# EAGLE schematic hydrogen_sensors_board_v4.0 (EAGLE 9.4.2)
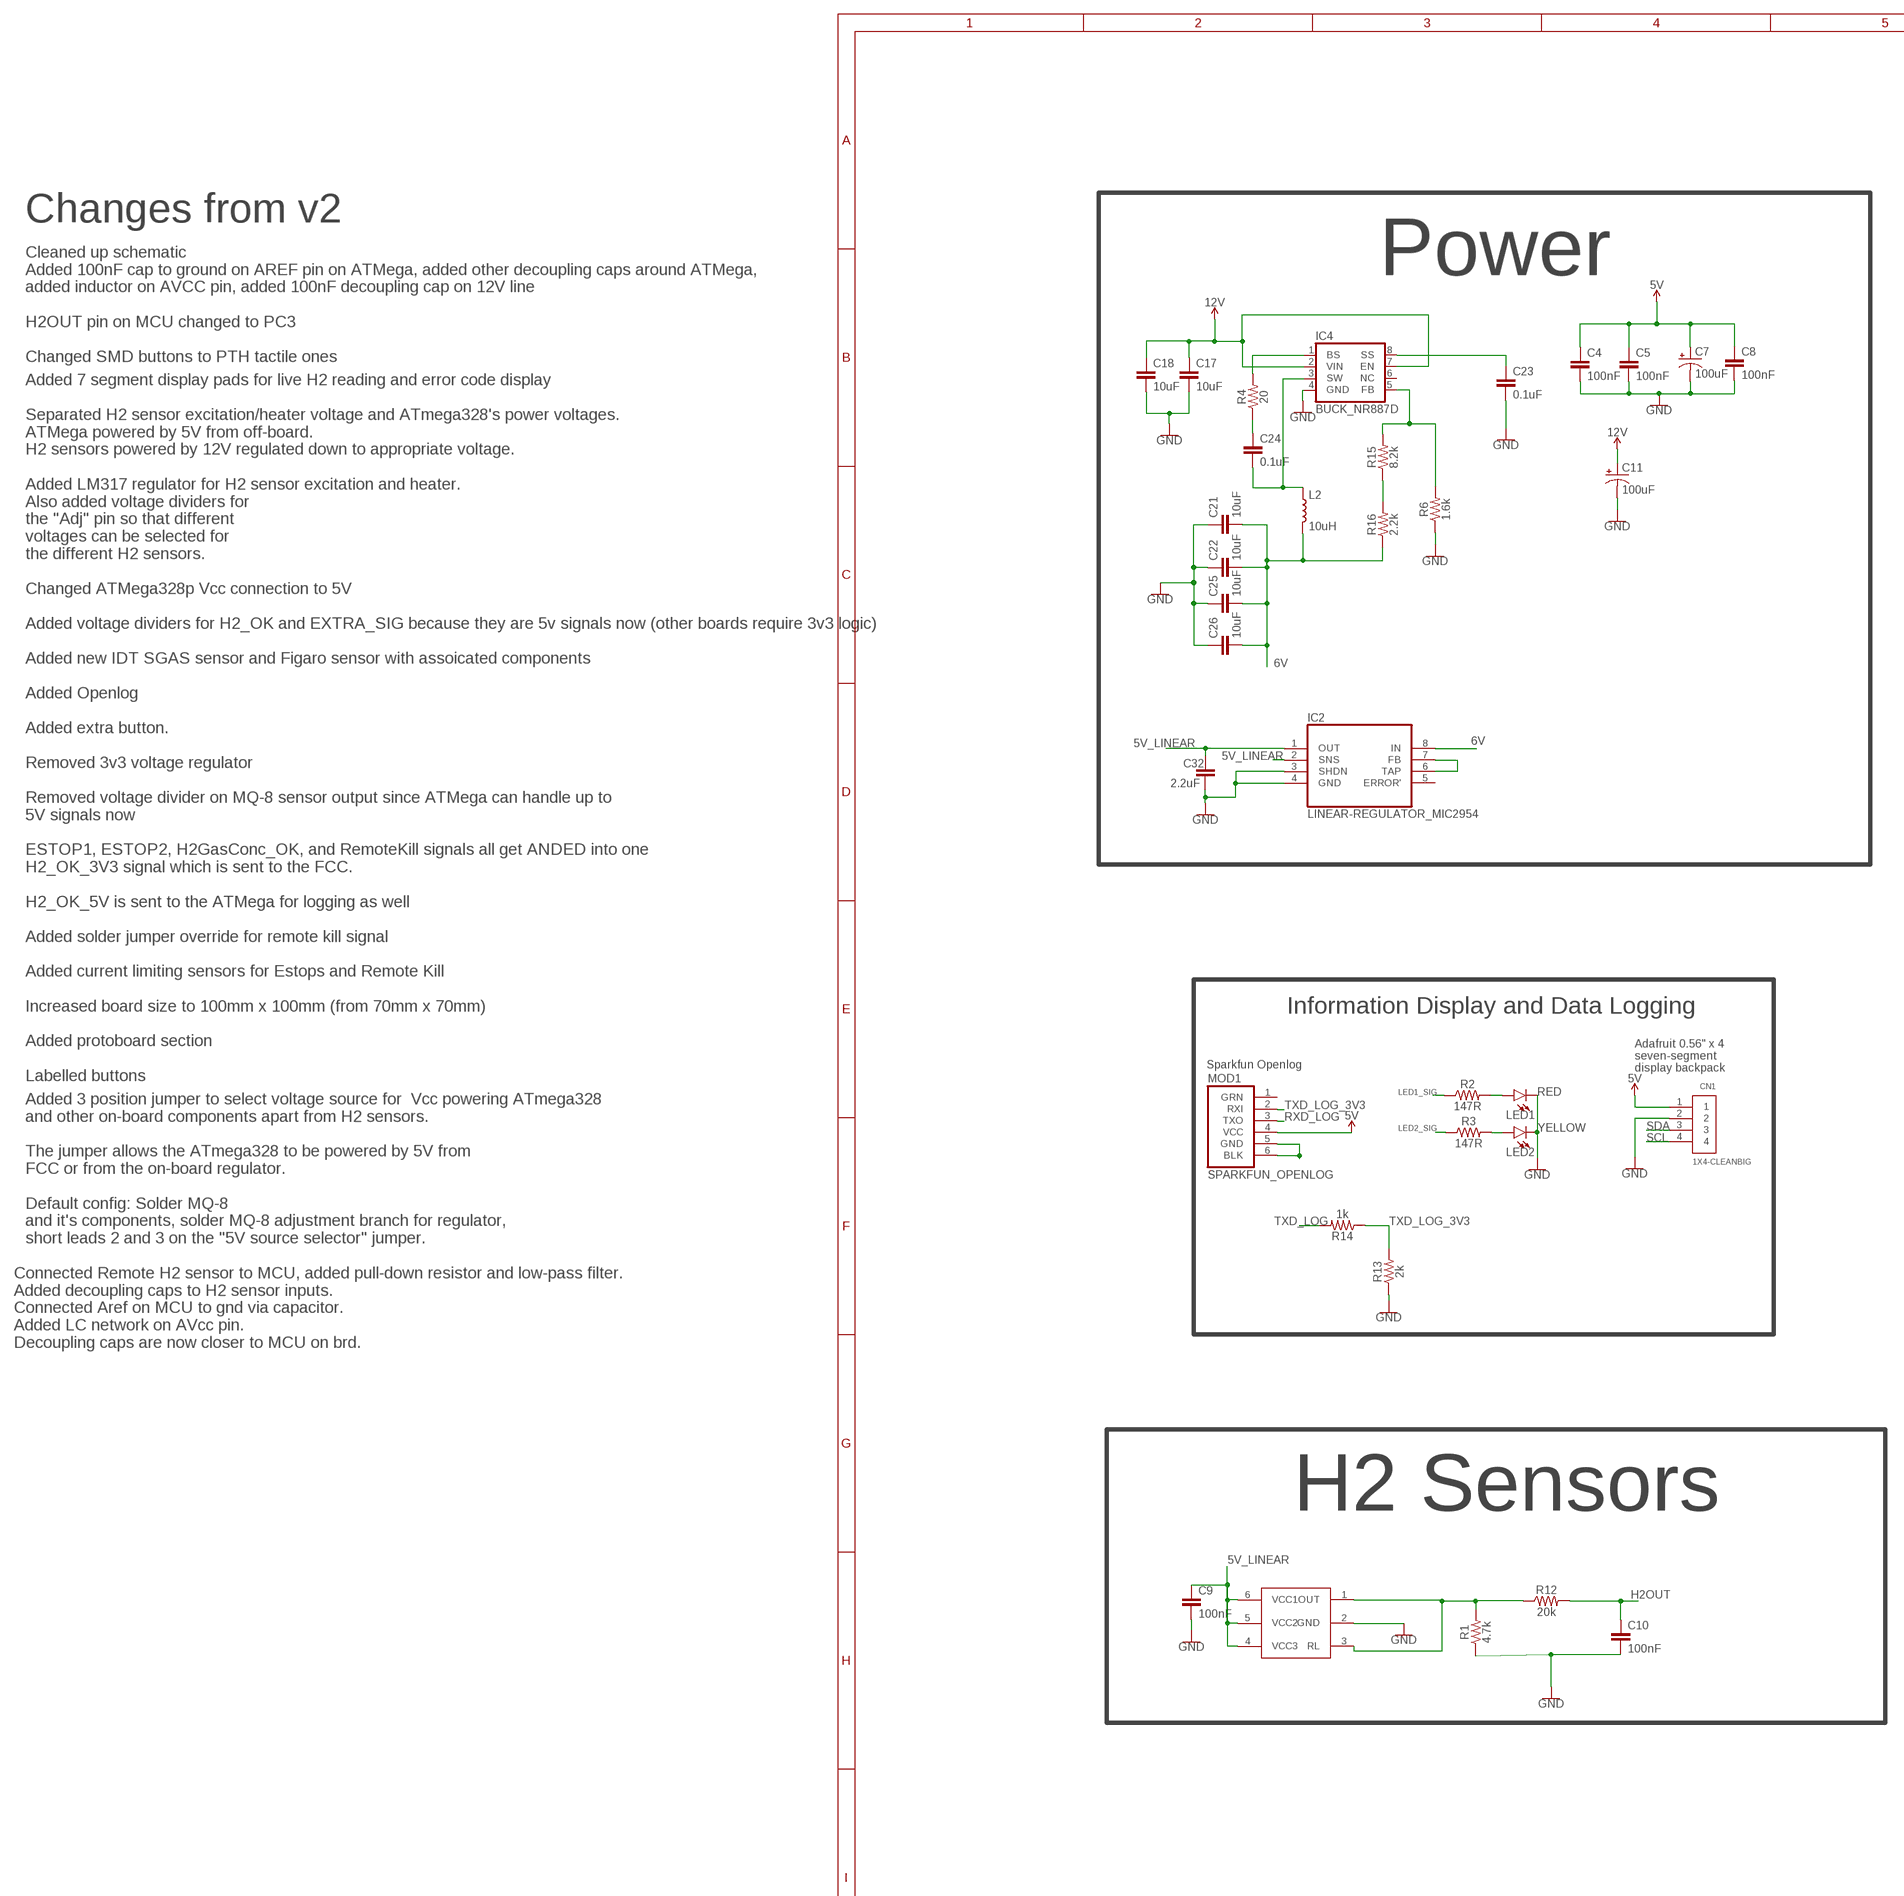
[diagram p0: schematic, sheet 1, part 1 of 2]
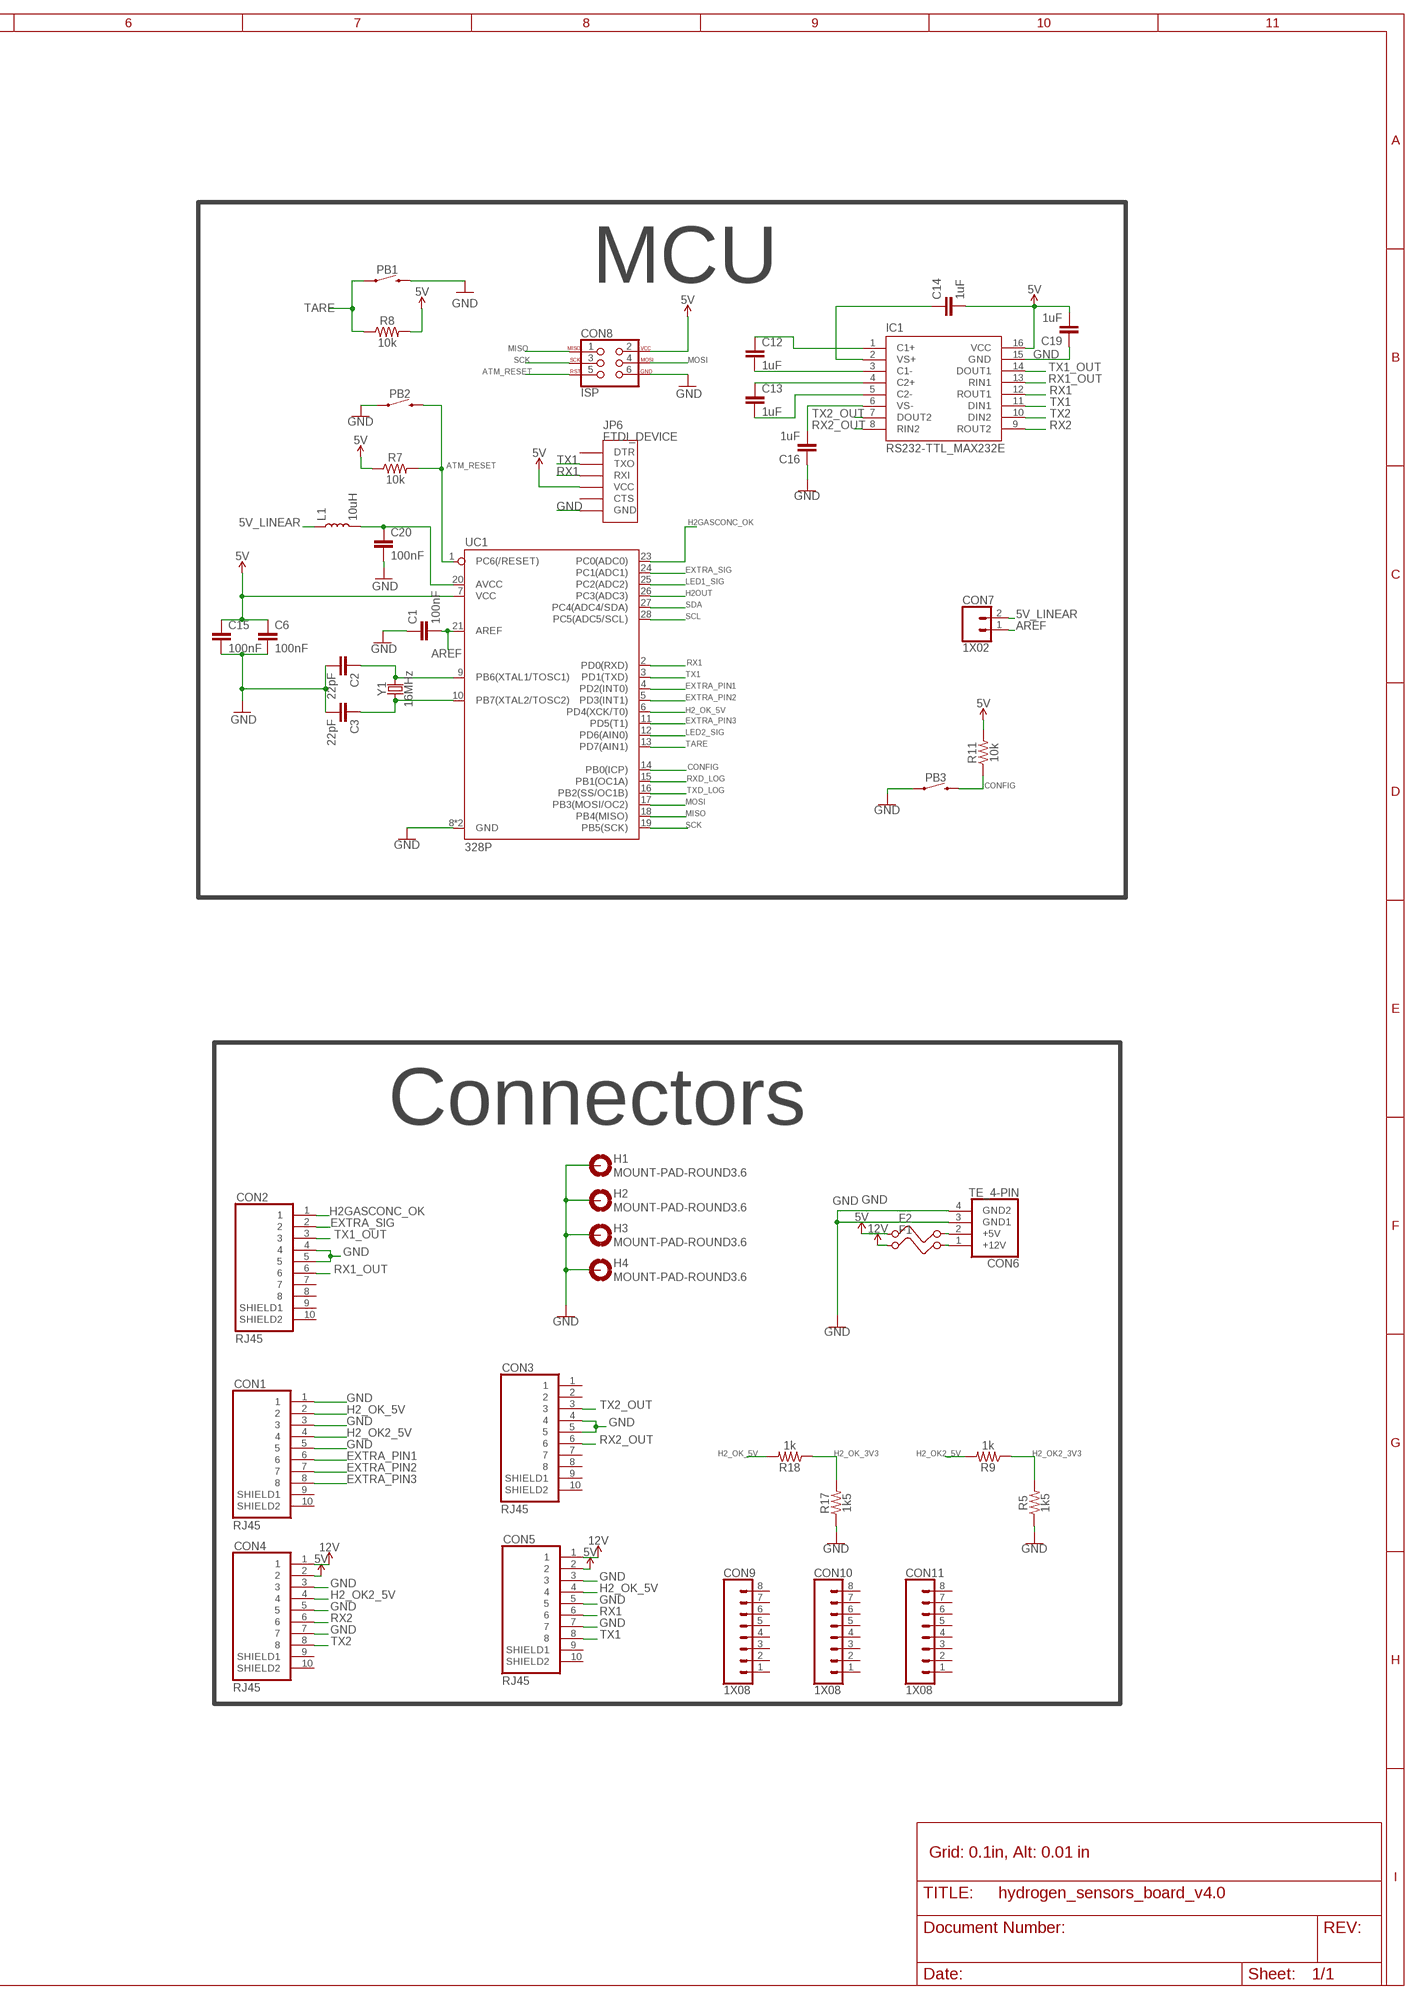
[diagram p1: schematic, sheet 1, part 2 of 2]

## Parts
C1  100nF  CAPACITOR_0805  [0805]
C2  22pF  CAPACITOR_0805  [0805]
C3  22pF  CAPACITOR_0805  [0805]
C4  100nF  CAPACITOR_0805  [0805]
C5  100nF  CAPACITOR_0805  [0805]
C6  100nF  CAPACITOR_0805  [0805]
C7  100uF  CAPACITOR_ELECTROLYTIC_100UF  [CAPACITOR_100UF_50V]
C8  100nF  CAPACITOR_0805  [0805]
C9  100nF  CAPACITOR_0805  [0805]
C10  100nF  CAPACITOR_0805  [0805]
C11  100uF  CAPACITOR_ELECTROLYTIC_100UF  [CAPACITOR_100UF_50V]
C12  1uF  CAPACITOR_0805  [0805]
C13  1uF  CAPACITOR_0805  [0805]
C14  1uF  CAPACITOR_0805  [0805]
C15  100nF  CAPACITOR_0805  [0805]
C16  1uF  CAPACITOR_0805  [0805]
C17  10uF  CAPACITOR_0805  [0805]
C18  10uF  CAPACITOR_0805  [0805]
C19  1uF  CAPACITOR_0805  [0805]
C20  100nF  CAPACITOR_0805  [0805]
C21  10uF  CAPACITOR_1210  [1210]
C22  10uF  CAPACITOR_1210  [1210]
C23  0.1uF  CAPACITOR_0805  [0805]
C24  0.1uF  CAPACITOR_0805  [0805]
C25  10uF  CAPACITOR_1210  [1210]
C26  10uF  CAPACITOR_1210  [1210]
C32  2.2uF  CAPACITOR_0805  [0805]
CN1  1X4-CLEANBIG  [1X04-CLEANBIG]
CON1  RJ45  [RJ45]
CON2  RJ45  [RJ45]
CON3  RJ45  [RJ45]
CON4  RJ45  [RJ45]
CON5  RJ45  [RJ45]
CON6  TE_4-PIN  [TE_4-PIN]
CON7  1X02  [1X02]
CON8  ISP  [ISP_CONNECTOR]
CON9  1X08  [1X08]
CON10  1X08  [1X08]
CON11  1X08  [1X08]
F1  FUSE_1210  [1210]
F2  FUSE_1210  [1210]
H1  MOUNT-PAD-ROUND3.6  [3,6-PAD]
H2  MOUNT-PAD-ROUND3.6  [3,6-PAD]
H3  MOUNT-PAD-ROUND3.6  [3,6-PAD]
H4  MOUNT-PAD-ROUND3.6  [3,6-PAD]
IC1  RS232-TTL_MAX232E  [DIP16]
IC2  LINEAR-REGULATOR_MIC2954  [SOIC8]
IC4  BUCK_NR887D  [DIP08]
JP6  FTDI_DEVICE  [FTDI_DEVICE_SIDE]
L1  10uH  INDUCTOR_0805  [0805]
L2  10uH  INDUCTOR_MURATA_DEM8030C  [INDUCTOR_MURATA_DEM8030C]
LED1  RED  LED_0805  [0805_LED]
LED2  YELLOW  LED_0805  [0805_LED]
MOD1  SPARKFUN_OPENLOG  [SPARKFUN_OPENLOG]
PB1  PUSHBUTTON  [PUSHBUTTON]
PB2  PUSHBUTTON  [PUSHBUTTON]
PB3  PUSHBUTTON  [PUSHBUTTON]
R1  4.7k  RESISTOR_0805  [0805]
R2  147R  RESISTOR_0805  [0805]
R3  147R  RESISTOR_0805  [0805]
R4  20  RESISTOR_0805  [0805]
R5  1k5  RESISTOR_0805  [0805]
R6  1.6k  RESISTOR_0805  [0805]
R7  10k  RESISTOR_0805  [0805]
R8  10k  RESISTOR_0805  [0805]
R9  1k  RESISTOR_0805  [0805]
R11  10k  RESISTOR_0805  [0805]
R12  20k  RESISTOR_0805  [0805]
R13  2k  RESISTOR_0805  [0805]
R14  1k  RESISTOR_0805  [0805]
R15  8.2k  RESISTOR_0805  [0805]
R16  2.2k  RESISTOR_0805  [0805]
R17  1k5  RESISTOR_0805  [0805]
R18  1k  RESISTOR_0805  [0805]
U$1  MQ-8MQ-8  [MQ-8]
UC1  328P  ATMEGA328P_DIP28  [DIP28]
Y1  16MHz  CRYSTAL-16MHZPTH-HC49US  [HC49US]

## Nets
5V: C4.1 C5.1 C6.1 C7.+ C8.1 C14.2 C15.1 C19.2 CN1.1 CON4.2 CON5.2 CON8.2 F2.1 IC1.16(VCC) JP6.P$4(VCC) MOD1.4(VCC) R7.1 R8.2 R11.2 UC1.7(VCC)
5V_LINEAR: C9.1 C32.1 CON7.2 IC2.1(OUT) IC2.2(SNS) L1.1 U$1.4(VCC3) U$1.5(VCC2) U$1.6(VCC1)
6V: C21.2 C22.2 C25.2 C26.2 IC2.8(IN) L2.P$2 R16.1
12V: C11.+ C17.1 C18.1 CON4.1 CON5.1 F1.1 IC4.2(VIN) IC4.7(EN)
AREF: C1.2 CON7.1 UC1.21(AREF)
ATM_RESET: CON8.5 PB2.3 PB2.4 R7.2 UC1.1(PC6(/RESET))
CONFIG: PB3.3 PB3.4 R11.1 UC1.14(PB0(ICP))
EXTRA_PIN1: CON1.6 UC1.4(PD2(INT0))
EXTRA_PIN2: CON1.7 UC1.5(PD3(INT1))
EXTRA_PIN3: CON1.8 UC1.11(PD5(T1))
EXTRA_SIG: CON2.2 UC1.24(PC1(ADC1))
GND: C1.1 C2.2 C3.2 C4.2 C5.2 C6.2 C7.- C8.2 C9.2 C10.2 C11.- C15.2 C16.1 C17.2 C18.2 C19.1 C20.2 C21.1 C22.1 C23.2 C25.1 C26.1 C32.2 CN1.2 CON1.1 CON1.3 CON1.5 CON2.4 CON2.5 CON3.4 CON3.5 CON4.3 CON4.5 CON4.7 CON5.3 CON5.5 CON5.7 CON6.3(GND1) CON6.4(GND2) CON8.6 H1.B3,6(MOUNT) H2.B3,6(MOUNT) H3.B3,6(MOUNT) H4.B3,6(MOUNT) IC1.15(GND) IC2.3(SHDN) IC2.4(GND) IC4.4(GND) JP6.P$6(GND) LED1.2(C) LED2.2(C) PB1.3 PB1.4 PB2.1 PB2.2 PB3.1 PB3.2 R1.1 R5.1 R6.1 R13.1 R17.1 U$1.2(GND) UC1.8(GND) UC1.22(GND)
H2_OK2_3V3: R5.2 R9.1
H2_OK2_5V: CON1.4 CON4.4 R9.2
H2_OK_3V3: R17.2 R18.1
H2_OK_5V: CON1.2 CON5.4 R18.2 UC1.6(PD4(XCK/T0))
H2GASCONC_OK: CON2.1 UC1.23(PC0(ADC0))
H2OUT: C10.1 R12.2 UC1.26(PC3(ADC3))
LED1_SIG: R2.1 UC1.25(PC2(ADC2))
LED2_SIG: R3.1 UC1.12(PD6(AIN0))
MISO: CON8.1 UC1.18(PB4(MISO))
MOSI: CON8.4 UC1.17(PB3(MOSI/OC2))
N$1: C2.1 UC1.9(PB6(XTAL1/TOSC1)) Y1.2
N$2: C23.1 IC4.8(SS)
N$3: C3.1 UC1.10(PB7(XTAL2/TOSC2)) Y1.1
N$4: CON6.2(+5V) F2.2
N$5: IC4.1(BS) R4.2
N$6: LED2.1(A) R3.2
N$7: LED1.1(A) R2.2
N$8: C24.1 R4.1
N$9: C24.2 IC4.3(SW) L2.P$1
N$10: IC4.5(FB) R6.2 R15.2
N$11: IC2.6(TAP) IC2.7(FB)
N$12: MOD1.5(GND) MOD1.6(BLK)
N$13: R15.1 R16.2
N$15: C12.2 IC1.3(C1-)
N$16: C12.1 IC1.1(C1+)
N$18: R1.2 R12.1 U$1.1(OUT) U$1.3(RL)
N$20: C13.1 IC1.4(C2+)
N$21: CON6.1(+12V) F1.2
N$22: C13.2 IC1.5(C2-)
N$23: C16.2 IC1.6(VS-)
N$25: C14.1 IC1.2(VS+)
N$62: C20.1 L1.2 UC1.20(AVCC)
RX1: CON5.6 IC1.12(ROUT1) JP6.P$3(RXI) UC1.2(PD0(RXD))
RX1_OUT: CON2.6 IC1.13(RIN1)
RX2: CON4.6 IC1.9(ROUT2)
RX2_OUT: CON3.6 IC1.8(RIN2)
RXD_LOG: MOD1.3(TXO) UC1.15(PB1(OC1A))
SCK: CON8.3 UC1.19(PB5(SCK))
SCL: CN1.4 UC1.28(PC5(ADC5/SCL))
SDA: CN1.3 UC1.27(PC4(ADC4/SDA))
TARE: PB1.1 PB1.2 R8.1 UC1.13(PD7(AIN1))
TX1: CON5.8 IC1.11(DIN1) JP6.P$2(TXO) UC1.3(PD1(TXD))
TX1_OUT: CON2.3 IC1.14(DOUT1)
TX2: CON4.8 IC1.10(DIN2)
TX2_OUT: CON3.3 IC1.7(DOUT2)
TXD_LOG: R14.2 UC1.16(PB2(SS/OC1B))
TXD_LOG_3V3: MOD1.2(RXI) R13.2 R14.1
Unconnected: CON1.9(SHIELD1) CON1.10(SHIELD2) CON2.7 CON2.8 CON2.9(SHIELD1) CON2.10(SHIELD2) CON3.1 CON3.2 CON3.7 CON3.8 CON3.9(SHIELD1) CON3.10(SHIELD2) CON4.9(SHIELD1) CON4.10(SHIELD2) CON5.9(SHIELD1) CON5.10(SHIELD2) CON9.1 CON9.2 CON9.3 CON9.4 CON9.5 CON9.6 CON9.7 CON9.8 CON10.1 CON10.2 CON10.3 CON10.4 CON10.5 CON10.6 CON10.7 CON10.8 CON11.1 CON11.2 CON11.3 CON11.4 CON11.5 CON11.6 CON11.7 CON11.8 IC2.5(ERROR') IC4.6(NC) JP6.P$1(DTR) JP6.P$5(CTS) MOD1.1(GRN)

## Notes on the sheet
- Changes from v2
- Power | MCU
- Cleaned up schematic
  Added 100nF cap to ground on AREF pin on ATMega, added other decoupling caps around ATMega, 
  added inductor on AVCC pin, added 100nF decoupling cap on 12V line
- H2OUT pin on MCU changed to PC3
- Changed SMD buttons to PTH tactile ones
- Added 7 segment display pads for live H2 reading and error code display
- Separated H2 sensor excitation/heater voltage and ATmega328's power voltages.
  ATMega powered by 5V from off-board.
  H2 sensors powered by 12V regulated down to appropriate voltage.
- Added LM317 regulator for H2 sensor excitation and heater.
  Also added voltage dividers for 
  the "Adj" pin so that different 
  voltages can be selected for
  the different H2 sensors.
- Changed ATMega328p Vcc connection to 5V
- Added voltage dividers for H2_OK and EXTRA_SIG because they are 5v signals now (other boards require 3v3 logic)
- Added new IDT SGAS sensor and Figaro sensor with assoicated components
- Added Openlog
- Added extra button.
- Removed 3v3 voltage regulator
- Removed voltage divider on MQ-8 sensor output since ATMega can handle up to 
  5V signals now
  
  ESTOP1, ESTOP2, H2GasConc_OK, and RemoteKill signals all get ANDED into one
  H2_OK_3V3 signal which is sent to the FCC.
- H2_OK_5V is sent to the ATMega for logging as well
- Added solder jumper override for remote kill signal
  
  Added current limiting sensors for Estops and Remote Kill
- Information Display and Data Logging
- Sparkfun Openlog
- Adafruit 0.56" x 4 
  seven-segment 
  display backpack
- Increased board size to 100mm x 100mm (from 70mm x 70mm)
  
  Added protoboard section
  
  Labelled buttons
- Connectors
- Added 3 position jumper to select voltage source for  Vcc powering ATmega328
  and other on-board components apart from H2 sensors.
  
  The jumper allows the ATmega328 to be powered by 5V from 
  FCC or from the on-board regulator.
  
  Default config: Solder MQ-8 
  and it's components, solder MQ-8 adjustment branch for regulator, 
  short leads 2 and 3 on the "5V source selector" jumper.
- Connected Remote H2 sensor to MCU, added pull-down resistor and low-pass filter.
  Added decoupling caps to H2 sensor inputs.
  Connected Aref on MCU to gnd via capacitor.
  Added LC network on AVcc pin.
  Decoupling caps are now closer to MCU on brd.
- H2 Sensors
- Grid: 0.1in, Alt: 0.01 in

## Library data of the parts
C1-C6 C8-C10 C12-C20 C23 C24 C32 = EcoCar-Passives:CAPACITOR_0805
C7 C11 = EcoCar-Passives:CAPACITOR_ELECTROLYTIC_100UF: 50V 100uF Electrolytic Capacitor Manufacturer: Nichicon Series: UVZ Part Number: UVZ1H101MPD1TD Digikey Part Number: 493-13464-1-ND
C21 C22 C25 C26 = EcoCar-Passives:CAPACITOR_1210
CN1 = adafruit:1X4: 4-pin connector
CON1-CON5 = EcoCar-Connectors:RJ45: RJ45 Connector - Use for signals and low power connections Unshielded Part Number: RJHSE-5080 Unshielded Digikey Part Number: RJHSE-5080-ND Shielded Part Number: RJHSE5E80 Shielded Digikey Part Number: RJHSE5E80-ND
CON6 = EcoCar-Connectors:TE_4-PIN: 4 Pin TE Mini-Universal MATE-N-LOK - Use for 12V and 5V connections Part Number: 1-770968-0 Digikey Part Number: A32474-ND Matching Plug: A25571-ND Matching Crimps: A100828CT-ND
CON7 = EcoCar-Connectors-2.54mm:1X02: 2.54mm (0.1") Header
CON8 = EcoCar-Microcontrollers:ISP: ISP Header Use for programming microcontrollers such as the 328P
CON9-CON11 = EcoCar-Connectors-2.54mm:1X08: 2.54mm (0.1") Header
F1 F2 = EcoCar-Fuses-Protection:FUSE_1210: 1210 Surface Mount Fuse
H1-H4 = holes:MOUNT-PAD-ROUND: MOUNTING PAD, round
IC1 = EcoCar-Integrated-Circuits:RS232-TTL_MAX232E: Dual 5V TTL to RS-232 Converter Manufacturer: Texas Instruments Part Number: MAX232EIN Digikey Part Number: 296-27963-5-ND
IC2 = EcoCar-Integrated-Circuits:LINEAR-REGULATOR_MIC2954: 5V/Adjustable 250mA Low-Dropout Linear Regulator Manufacturer: Microchip Part Number: MIC2954-08YM-TR Digikey Part Number: 576-1156-1-ND
IC4 = EcoCar-Integrated-Circuits:BUCK_NR887D: Sanken 2A Buck Converter Manufacturer: Sanken Part Number: NR887D Digikey Part Number: NR887D-ND
JP6 = SparkFun-Connectors:FTDI_DEVICE: Connector which mates to FTDI basic or FTDI cable.
L1 = EcoCar-Passives:INDUCTOR_0805
L2 = EcoCar-Passives:INDUCTOR_MURATA_DEM8030C: Murata DEM8030C Series Inductor Manufacturer: Murata Series: DEM8030C Example Part: 10uH 3.1A Part Number: 1273AS-H-100M=P3 Digikey Part Number: 490-10837-1-ND
LED1 LED2 = EcoCar-Discrete-Semiconductors:LED_0805
MOD1 = EcoCar-Modules:SPARKFUN_OPENLOG: Sparkfun Openlog Manufacturer: Sparkfun Part Number: DEV-13712 Digikey Part Number: 1568-1368-ND
PB1-PB3 = EcoCar-Electromechanical:PUSHBUTTON: Pushbutton Manufacturer: TE Connectivity ALCOSWITCH Switches Part Number: 1825910-6 Digikey Part Number: 450-1650-ND
R1-R9 R11-R18 = EcoCar-Passives:RESISTOR_0805
U$1 = donny_library:MQ-8
UC1 = EcoCar-Microcontrollers:ATMEGA328P_DIP28: ATmega328P Manufacturer: Microchip Part Number: ATMEGA328P-PU Digikey Part Number: ATMEGA328P-PU-ND; PROD_ID: IC-09136
Y1 = EcoCar-Microcontrollers:CRYSTAL-16MHZ: 16MHz Crystal Oscillator Manufacturer: TXC Part Number: 9B-16.000MBBK-B Digikey Part Number: 887-2015-ND; PROD_ID: XTAL-08181; SF_ID: COM-00536